# EAGLE design LED Board (EAGLE 9.6.2)
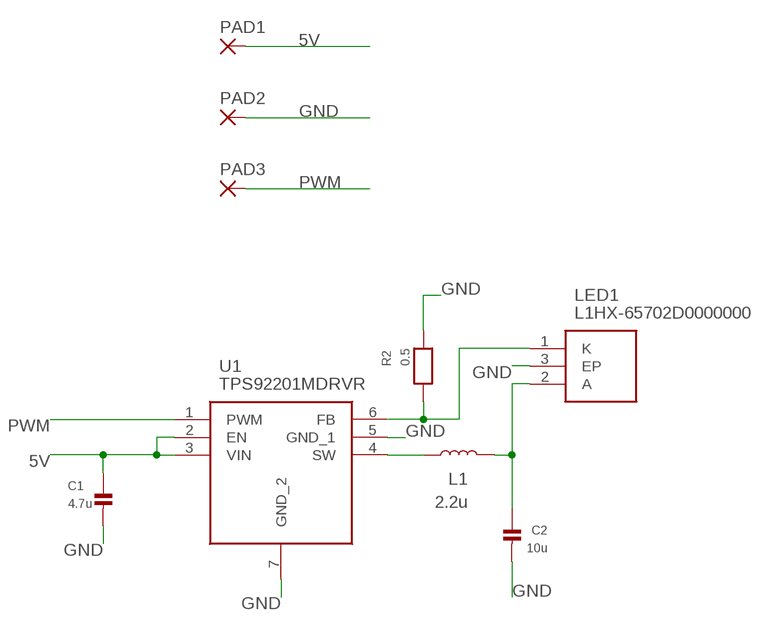
[diagram p0: schematic, sheet 1]

## Parts
C1  4.7u  CAP_CERAMIC0805  [0805]
C2  10u  CAP_CERAMIC0805  [0805]
L1  2.2u  2.2μH  [1008(2520)]
LED1  L1HX-65702D0000000  [L1HX65702D0000000]
PAD1  SMD2  [SMD1,27-2,54]
PAD2  SMD2  [SMD1,27-2,54]
PAD3  SMD2  [SMD1,27-2,54]
R2  0.5  RESISTOR_R0603  [R0603]
U1  TPS92201MDRVR  [SON65P200X200X80-7N]

## Nets
5V: C1.1 PAD1.1(P) U1.2(EN) U1.3(VIN)
GND: C1.2 C2.2 LED1.3(EP) PAD2.1(P) R2.2 U1.5(GND_1) U1.7(GND_2)
N$2: L1.1 U1.4(SW)
N$3: C2.1 L1.2 LED1.2(A)
N$5: LED1.1(K) R2.1 U1.6(FB)
PWM: PAD3.1(P) U1.1(PWM)

## Library data of the parts
C1 C2 = Anran_microbuilder:CAP_CERAMIC: Ceramic Capacitors 0402 - 0402 Surface Mount Capacitors 0603 - 0603 Surface Mount Capacitors 0805 - 0805 Surface Mount Capacitors 1206 - 1206 Surface Mount Capacitors
L1 = SparkFun-Coils:2.2μH: 2.2μH Inductor Resist changes in electrical current. Basically a coil of wire. SparkFun Products: SparkFun Edge - HX711 <https://www.sparkfun.com/products/15170>
LED1 = L1HX-65702D0000000:L1HX-65702D0000000: High Power LEDs - White White 6500 K 70-CRI, LUXEON HL2X Source: Datasheet <https://eu.mouser.com/datasheet/2/602/DS288_luxeon_hl2x_datasheet-1915899.pdf>; DESCRIPTION: High Power LEDs - White White 6500 K 70-CRI, LUXEON HL2X; HEIGHT: 2.385mm; MANUFACTURER_NAME: Lumileds; MANUFACTURER_PART_NUMBER: L1HX-65702D0000000; MOUSER_PART_NUMBER: 997-L1HX65702D00; MOUSER_PRICE-STOCK: https://www.mouser.co.uk/ProductDetail/Lumileds/L1HX-65702D0000000?qs=rQFj71Wb1eWfHahR7D6%252B7g%3D%3D
PAD1-PAD3 = wirepad:SMD2: SMD PAD
R2 = Anran_microbuilder:RESISTOR: Resistors 0402 - 0402 Surface Mount Package 0603 - 0603 Surface Mount Package 0805 - 0805 Surface Mount Package 1206 - 1206 Surface Mount Package 2012 - 2010 Surface Mount Package
U1 = TPS92201MDRVR:TPS92201MDRVR: LED Lighting Drivers LAKE JINJI NORMAL DIE WSON ET DEVICE Source: Datasheet <https://www.ti.com/lit/ds/symlink/tps92201.pdf?ts=1713775537663&ref_url=https%3A%2F%2Fwww.ti.com%2Fproduct%2FTPS92201>; DESCRIPTION: LED Lighting Drivers LAKE JINJI NORMAL DIE WSON ET DEVICE; HEIGHT: 0.8mm; MANUFACTURER_NAME: Texas Instruments; MANUFACTURER_PART_NUMBER: TPS92201MDRVR; MOUSER_PART_NUMBER: 595-TPS92201MDRVR; MOUSER_PRICE-STOCK: https://www.mouser.co.uk/ProductDetail/Texas-Instruments/TPS92201MDRVR?qs=Z%252BL2brAPG1I7tDusbKYo3Q%3D%3D

## Net classes
0 SIG: width 0.152 mm, drill 0.3 mm, clearance 0.152 mm
1 POW: width 0.6 mm, drill 0.3 mm, clearance 0.152 mm

## Board
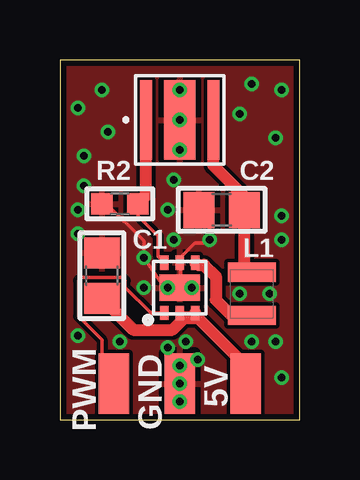
[diagram p1: board, top side]
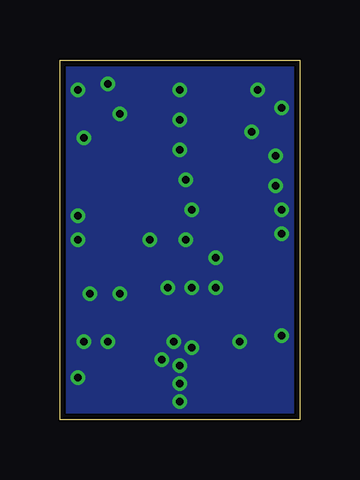
[diagram p2: board, bottom side, seen from below]

Size 10 x 15 mm. Coordinates in mm from the lower left corner, seen from the top.
Outline: 0,0 10,0 10,15 0,15 0,0
Copper layers (1*16): Top 0.035mm / dielectric 0.73mm / Bottom 0.035mm
Design rules "default *": minimum track width 5mil, minimum drill 0.3mm, track to track 6mil, track to pad 6mil, pad to pad 6mil, via to via 6mil, smd to smd 0mil, copper to edge 10mil, drill to drill 10mil, minimum pad ring 6mil, minimum via ring 6mil, stop-mask expansion 4mil, vias tented up to drill 0.3mm, thermal gap 10mil

### Footprints (pad centres in the part's own frame; a part is rotated, then mirrored left to right if it is on the bottom)
0805 = smd 1.3 x 1.5: 1 -0.95,0; 2 0.95,0
1008(2520) = smd 0.8 x 2: 1 -0.9,0; 2 0.9,0
L1HX65702D0000000 = smd 0.5 x 3.3: 1 -1.4,0; 2 1.4,0 | smd 1.3 x 3.3: 3 0,0
SMD1,27-2,54 = smd 1.27 x 2.54: 1 0,0
R0603 = smd 0.9 x 0.9: 1 -0.75,0; 2 0.75,0
SON65P200X200X80-7N = smd 0.6 x 0.35: 1 -1.05,0.65; 2 -1.05,0; 3 -1.05,-0.65; 4 1.05,-0.65; 5 1.05,0; 6 1.05,0.65 | smd 1.1 x 1.7: 7 0,0

### Placement (x,y rotation side)
C1  1.75,6 90 top
C2  6.75,8.75 180 top
L1  8,5.25 90 top
LED1  5,12.5 0 top
PAD1  7.75,1.5 0 top
PAD2  5,1.5 0 top
PAD3  2.25,1.5 0 top
R2  2.5,9 180 top
U1  5,5.5 90 top

### Tracks (layer width: path | path; a pad name or v marks a point on that pad's centre or on a via)
5V
  Top 0.152: U1.2 5.55,4.45 5.65,4.35
  Top 0.5: PAD1.1 7.75,2.25 5.65,4.35 | 5.65,4.35 5.65,4.25 5.19,4.25 4.69,3.75 3.05,3.75 C1.1 | 5.65,4.35 U1.3
GND  (via drill 0.3)
  Top 0.152: 1.68,9.08 R2.2 1.95,9 3.5,7.45 v3.5,6.75 4.16,5.79 4.42,5.53 U1.7 | U1.7 4.57,5.53 v4.5,5.5 4.42,5.38 | 5.03,5.53 5.49,5.53 v5.5,5.5 | 5.03,5.53 5.03,6.45 U1.5 5.03,6.6 5.03,6.75 5.64,7.36 6.25,7.36 v6.25,7.5 6.25,7.52 6.25,8.43 5.94,8.73 C2.2 5.79,8.89 | 5.03,5.53 U1.7
  other vias: 0.75,7.75 1,9.75 0.75,8.75 7.5,5.25 8.75,5.25 9.25,7.5 9.25,8.5 4.5,8.75 5,0.75 4.75,10 3.5,5.5 4.75,7.5 9.25,1.75 9,3.25 5,2.25 5.25,3.25 5,1.5 0.75,3.5 5,11.25 5,12.5 5,13.75 1.75,13.75 0.75,13 2,12 1,11 8,14 9.25,13.75 7.5,12.75 9,11.75 5.75,2.5 4.5,3 2.5,3.25 8,3.25
  pour Bottom: -2,17 12,17 12,-2 -2,-2
  pour Top: -1,16 11,16 11,-1 -1,-1
N$2
  Top 0.5: U1.4 5.75,6.45 6.02,6.45 6.5,5.97 6.5,5 7.15,4.35 L1.1
N$3
  Top 0.5: L1.2 7.7,6.45 C2.1 7.7,9.3 6.4,10.6 LED1.2
N$5
  Top 0.152: R2.1 3.25,8.5 4.1,7.65 4.1,6.8 U1.6
  Top 0.5: LED1.1 3.6,9.35 R2.1
PWM
  Top 0.152: U1.1 3.8,4.45 2.73,5.52 2.73,5.79 2.6,5.93 0.91,5.93 0.77,5.79 0.77,4.3 1.75,3.33 1.75,2 PAD3.1

### Text on the board
tPlace: PWM | GND | 5V